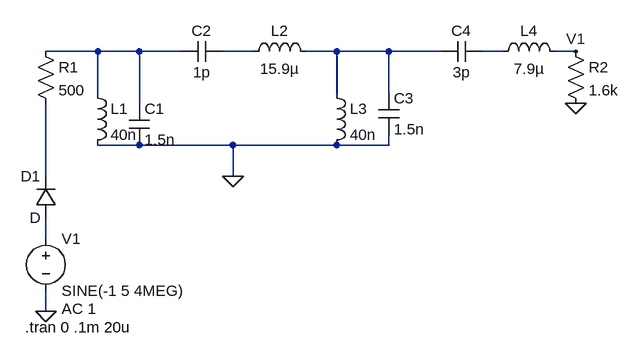
[diagram p0: schematic Filter.asc]
Filter.asc, the LTspice schematic file:
Version 4
SHEET 1 880 680
WIRE 48 96 -32 96
WIRE 112 96 48 96
WIRE 176 96 112 96
WIRE 288 96 240 96
WIRE 416 96 368 96
WIRE 496 96 416 96
WIRE 576 96 496 96
WIRE 672 96 640 96
WIRE 784 96 752 96
WIRE 48 160 48 96
WIRE 416 160 416 96
WIRE 496 160 496 96
WIRE 112 176 112 96
WIRE 112 240 48 240
WIRE 256 240 112 240
WIRE 416 240 256 240
WIRE 496 240 496 224
WIRE 496 240 416 240
WIRE -32 288 -32 176
WIRE 256 288 256 240
WIRE -32 384 -32 352
WIRE -32 496 -32 464
FLAG 256 288 0
FLAG 784 176 0
FLAG 784 96 V1
FLAG -32 496 0
SYMBOL cap 96 176 R0
SYMATTR InstName C1
SYMATTR Value 1.5n
SYMBOL ind 32 144 R0
SYMATTR InstName L1
SYMATTR Value 40n
SYMBOL cap 240 80 R90
WINDOW 0 0 32 VBottom 2
WINDOW 3 32 32 VTop 2
SYMATTR InstName C2
SYMATTR Value 1p
SYMBOL ind 272 112 R270
WINDOW 0 32 56 VTop 2
WINDOW 3 5 56 VBottom 2
SYMATTR InstName L2
SYMATTR Value 15.9µ
SYMBOL ind 400 144 R0
SYMATTR InstName L3
SYMATTR Value 40n
SYMBOL cap 480 160 R0
SYMATTR InstName C3
SYMATTR Value 1.5n
SYMBOL res -48 80 R0
SYMATTR InstName R1
SYMATTR Value 500
SYMBOL res 768 80 R0
SYMATTR InstName R2
SYMATTR Value 1.6k
SYMBOL voltage -32 368 R0
WINDOW 123 24 124 Left 2
WINDOW 39 0 0 Left 2
SYMATTR Value2 AC 1
SYMATTR InstName V1
SYMATTR Value SINE(-1 5 4MEG)
SYMBOL cap 640 80 R90
WINDOW 0 0 32 VBottom 2
WINDOW 3 32 32 VTop 2
SYMATTR InstName C4
SYMATTR Value 3p
SYMBOL ind 656 112 R270
WINDOW 0 32 56 VTop 2
WINDOW 3 5 56 VBottom 2
SYMATTR InstName L4
SYMATTR Value 7.9µ
SYMBOL diode -16 352 R180
WINDOW 0 24 64 Left 2
WINDOW 3 24 0 Left 2
SYMATTR InstName D1
TEXT -64 520 Left 2 !.tran 0 .1m 20u

The netlist it stands for:
* Filter.asc
C1 N001 0 1.5n
L1 N001 0 40n
C2 N002 N001 1p
L2 N002 N003 15.9µ
L3 N003 0 40n
C3 N003 0 1.5n
R1 N001 N005 500
R2 V1 0 1.6k
V1 N006 0 SINE(-1 5 4MEG) AC 1
C4 N004 N003 3p
L4 N004 V1 7.9µ
D1 N006 N005 D
.model D D
.lib standard.dio
.tran 0 .1m 20u
.backanno
.end